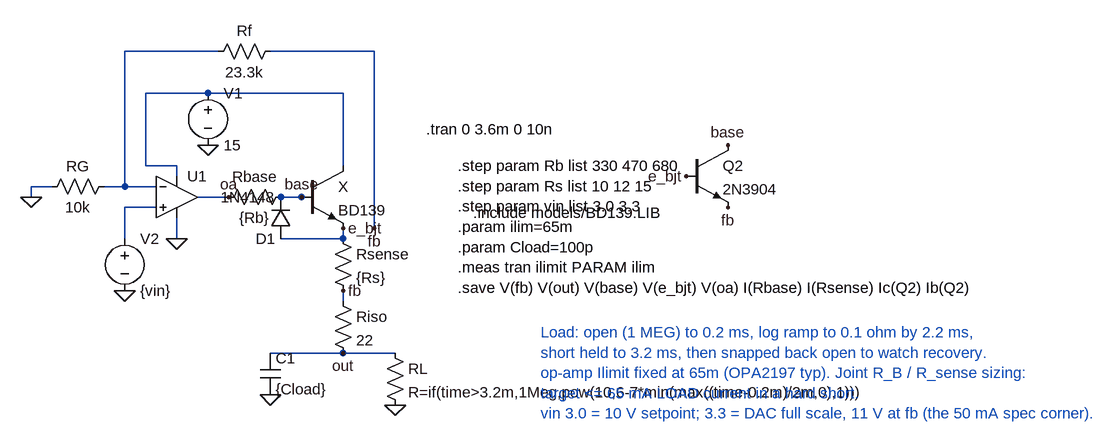
[diagram p0: schematic 11_limit_sizing.asc]
11_limit_sizing.asc, the LTspice schematic file:
Version 4.1
SHEET 1 1460 680
WIRE 320 -32 176 -32
WIRE 560 -32 400 -32
WIRE 304 32 208 32
WIRE 512 32 304 32
WIRE 208 144 208 32
WIRE 256 144 208 144
WIRE 512 144 512 32
WIRE 256 160 256 144
WIRE 64 176 32 176
WIRE 176 176 176 -32
WIRE 176 176 144 176
WIRE 224 176 176 176
WIRE 32 192 32 176
WIRE 336 192 288 192
WIRE 448 192 416 192
WIRE 464 192 448 192
WIRE 224 208 176 208
WIRE 560 240 560 -32
WIRE 176 256 176 208
WIRE 256 256 256 224
WIRE 512 256 512 240
WIRE 512 352 512 336
WIRE 512 432 400 432
WIRE 592 432 512 432
WIRE 512 256 416 256
FLAG 176 336 0
FLAG 32 192 0
FLAG 592 512 0
FLAG 256 256 0
FLAG 304 112 0
FLAG 400 496 0
FLAG 512 240 e_bjt
FLAG 560 240 fb
FLAG 512 336 fb
FLAG 512 432 out
FLAG 448 192 base
FLAG 336 192 oa
FLAG 1104 112 base
FLAG 1040 160 e_bjt
FLAG 1104 208 fb
SYMBOL OpAmps\\UniversalOpAmp2 256 192 R0
SYMATTR InstName U1
SYMATTR SpiceLine Ilimit={ilim} Rail=0 Vos=0
SYMBOL voltage 176 240 R0
WINDOW 123 0 0 Left 0
WINDOW 39 0 0 Left 0
SYMATTR InstName V2
SYMATTR Value {vin}
SYMBOL res 160 160 R90
WINDOW 0 0 56 VBottom 2
WINDOW 3 32 56 VTop 2
SYMATTR InstName RG
SYMATTR Value 10k
SYMBOL npn 448 144 R0
SYMATTR InstName X
SYMATTR Value BD139
SYMATTR Prefix X
SYMBOL diode 432 256 R180
SYMATTR InstName D1
SYMATTR Value 1N4148
SYMBOL res 416 -48 R90
WINDOW 0 0 56 VBottom 2
WINDOW 3 32 56 VTop 2
SYMATTR InstName Rf
SYMATTR Value 23.3k
SYMBOL res 576 416 R0
SYMATTR InstName RL
SYMATTR Value R=if(time>3.2m,1Meg,pow(10,6-7*min(max((time-0.2m)/2m,0),1)))
SYMBOL voltage 304 16 R0
SYMATTR InstName V1
SYMATTR Value 15
SYMBOL res 432 176 R90
WINDOW 0 0 56 VBottom 2
WINDOW 3 32 56 VTop 2
SYMATTR InstName Rbase
SYMATTR Value {Rb}
SYMBOL cap 384 432 R0
SYMATTR InstName C1
SYMATTR Value {Cload}
SYMBOL res 496 240 R0
SYMATTR InstName Rsense
SYMATTR Value {Rs}
SYMBOL res 496 336 R0
SYMATTR InstName Riso
SYMATTR Value 22
SYMBOL npn 1040 112 R0
SYMATTR InstName Q2
SYMATTR Value 2N3904
TEXT 640 88 Left 2 !.tran 0 3.6m 0 10n
TEXT 712 216 Left 2 !.include models/BD139.LIB
TEXT 688 144 Left 2 !.step param Rb list 330 470 680\n.step param Rs list 10 12 15\n.step param vin list 3.0 3.3\n.param ilim=65m\n.param Cload=100p\n.meas tran ilimit PARAM ilim\n.save V(fb) V(out) V(base) V(e_bjt) V(oa) I(Rbase) I(Rsense) Ic(Q2) Ib(Q2)
TEXT 816 400 Left 2 ;Load: open (1 MEG) to 0.2 ms, log ramp to 0.1 ohm by 2.2 ms,\nshort held to 3.2 ms, then snapped back open to watch recovery.\nop-amp Ilimit fixed at 65m (OPA2197 typ). Joint R_B / R_sense sizing:\ntarget <= 65 mA LOAD current in a hard short.\nvin 3.0 = 10 V setpoint; 3.3 = DAC full scale, 11 V at fb (the 50 mA spec corner).

The netlist it stands for:
* 11_limit_sizing.asc
X§U1 N003 N001 N002 0 oa level2 Avol=1Meg GBW=10Meg Slew=10Meg Ilimit={ilim} Rail=0 Vos=0 En=0 Enk=0 In=0 Ink=0 Rin=500Meg  ; pins In+ In- V+ V- OUT
V2 N003 0 {vin}
RG N001 0 10k
X§X N002 base e_bjt BD139  ; pins C B E
D1 e_bjt base 1N4148
Rf fb N001 23.3k
RL out 0 R=if(time>3.2m,1Meg,pow(10,6-7*min(max((time-0.2m)/2m,0),1)))
V1 N002 0 15
Rbase base oa {Rb}
C1 out 0 {Cload}
Rsense e_bjt fb {Rs}
Riso fb out 22
Q2 base e_bjt fb 0 2N3904
.model D D
.lib standard.dio
.model NPN NPN
.model PNP PNP
.lib standard.bjt
.tran 0 3.6m 0 10n
.include models/BD139.LIB
.step param Rb list 330 470 680
.step param Rs list 10 12 15
.step param vin list 3.0 3.3
.param ilim=65m
.param Cload=100p
.meas tran ilimit PARAM ilim
.save V(fb) V(out) V(base) V(e_bjt) V(oa) I(Rbase) I(Rsense) Ic(Q2) Ib(Q2)
* Load: open (1 MEG) to 0.2 ms, log ramp to 0.1 ohm by 2.2 ms,
* short held to 3.2 ms, then snapped back open to watch recovery.
* op-amp Ilimit fixed at 65m (OPA2197 typ). Joint R_B / R_sense sizing:
* target <= 65 mA LOAD current in a hard short.
* vin 3.0 = 10 V setpoint; 3.3 = DAC full scale, 11 V at fb (the 50 mA spec corner).
.lib UniversalOpAmp2.lib
.backanno
.end